# EAGLE design FreedomWingSMD (EAGLE 9.6.2)
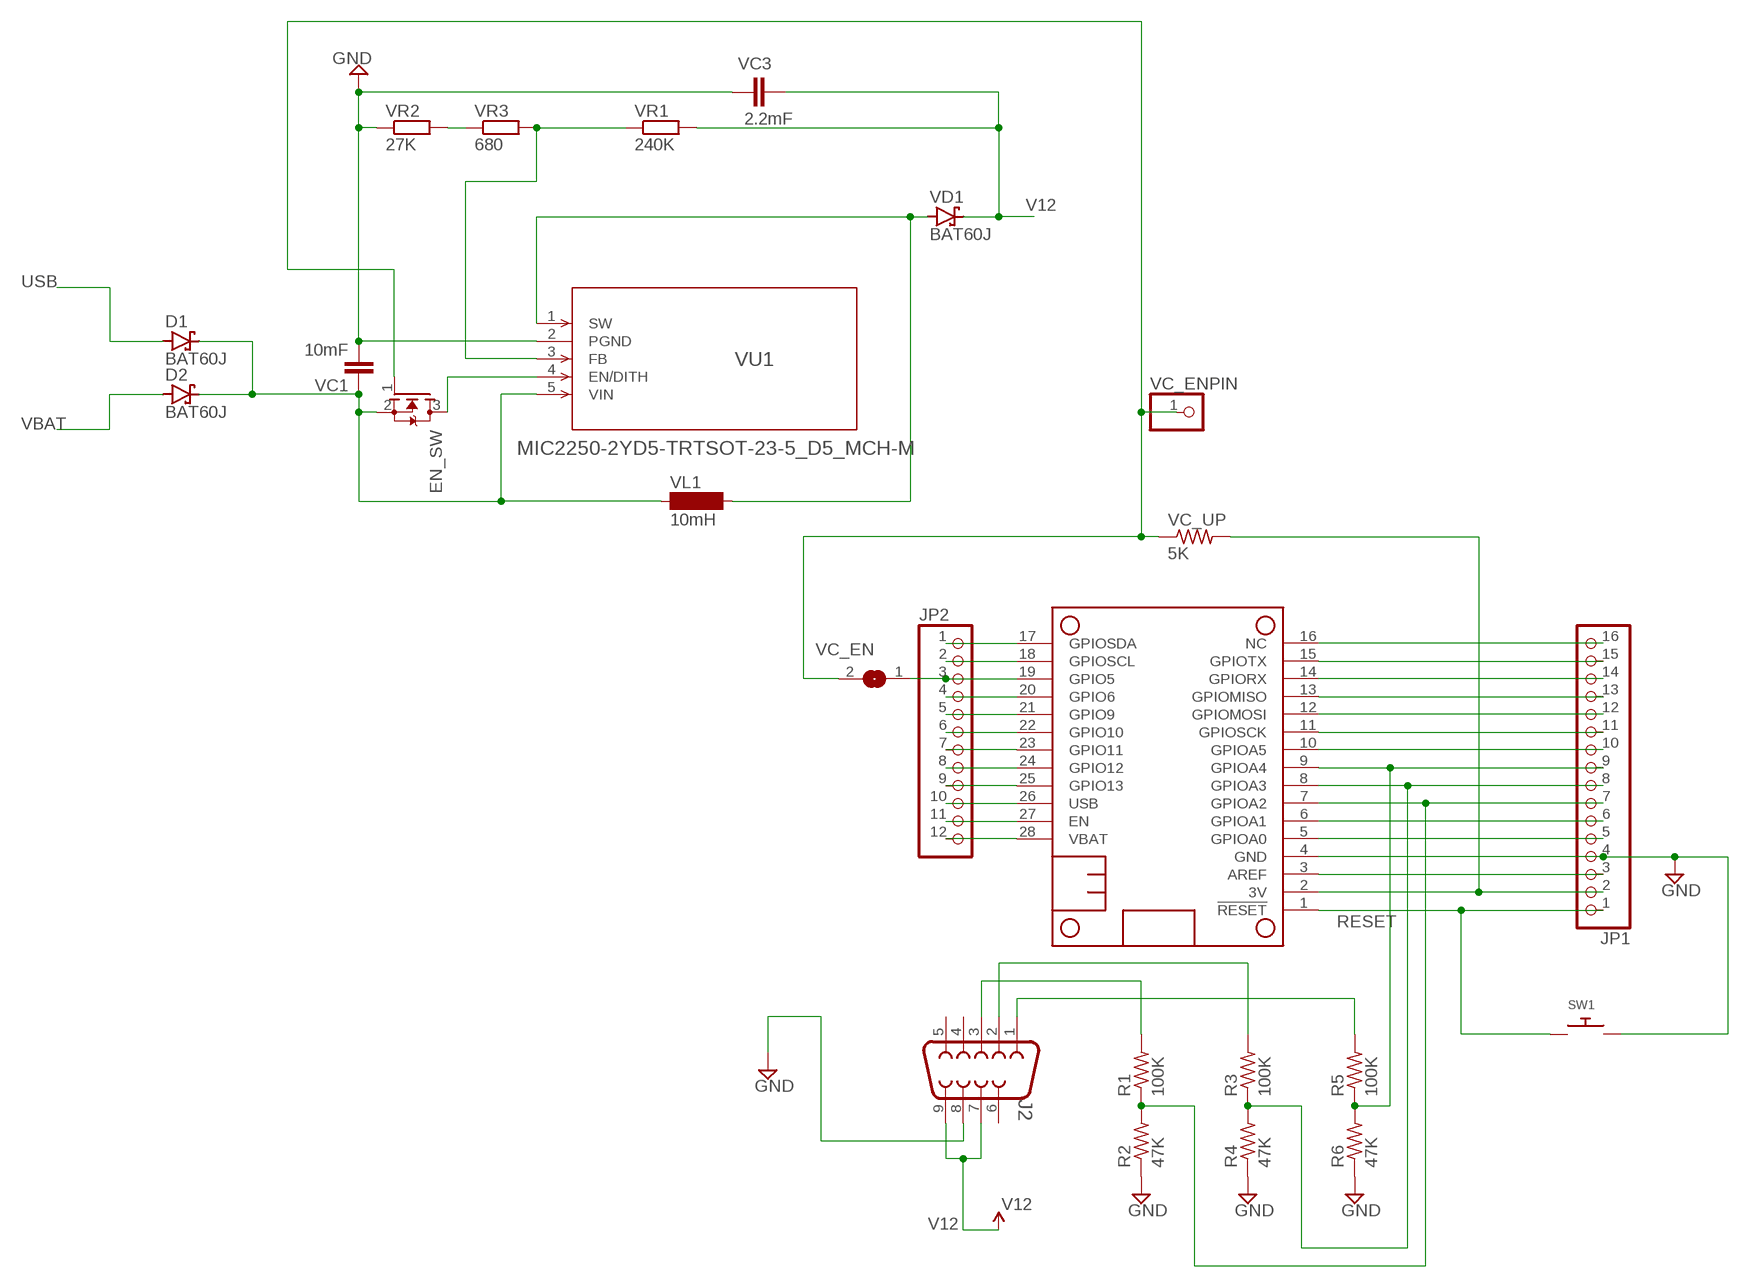
[diagram p0: schematic, sheet 1]

## Parts
D1  BAT60J  [SOD323_ST]
D2  BAT60J  [SOD323_ST]
EN_SW  MOSFET-NREFLOW  [SOT23]
J2  DB9MALE  [DB9_MALE]
JP1  PINHD-1X16  [1X16]
JP2  PINHD-1X12  [1X12]
MS1  FEATHERWING_NODIM  [FEATHERWING_DIM]
R1  100K  R-US_R0805  [R0805]
R2  47K  R-US_R0805  [R0805]
R3  100K  R-US_R0805  [R0805]
R4  47K  R-US_R0805  [R0805]
R5  100K  R-US_R0805  [R0805]
R6  47K  R-US_R0805  [R0805]
SW1  SWITCH_PUSHBUTTONC&K_KSS  [BTN_CK_KSS]
VC1  10mF  C-EUC0805  [C0805]
VC3  2.2mF  C-EUC0805  [C0805]
VC_EN  SJW  [SJW]
VC_ENPIN  PINHD-1X1  [1X01]
VC_UP  5K  R-US_R0805  [R0805]
VD1  BAT60J  [SOD323_ST]
VL1  10mH  MS50  [MS50]
VR1  240K  R-EU_R0805W  [R0805W]
VR2  27K  R-EU_R0805W  [R0805W]
VR3  680  R-EU_R0805W  [R0805W]
VU1  MIC2250-2YD5-TRTSOT-23-5_D5_MCH-M  [TSOT-23-5_D5_MCH-M]

## Nets
3V: JP1.2 MS1.2(3V) VC_UP.2
GND: J2.8 JP1.4 MS1.4(GND) R2.1 R4.1 R6.1 SW1.P$2 VC1.2 VC3.1 VR2.1 VU1.2(PGND)
N$1: J2.3 R1.2
N$2: JP2.1 MS1.17(GPIOSDA)
N$3: JP2.2 MS1.18(GPIOSCL)
N$4: JP2.3 MS1.19(GPIO5) VC_EN.1
N$5: JP1.7 MS1.7(GPIOA2) R1.1 R2.2
N$6: JP1.8 MS1.8(GPIOA3) R3.1 R4.2
N$7: JP1.9 MS1.9(GPIOA4) R5.1 R6.2
N$8: VR1.1 VR3.2 VU1.3(FB)
N$9: J2.2 R3.2
N$10: J2.1 R5.2
N$11: JP2.4 MS1.20(GPIO6)
N$12: JP2.5 MS1.21(GPIO9)
N$13: JP2.6 MS1.22(GPIO10)
N$14: JP2.7 MS1.23(GPIO11)
N$15: JP2.8 MS1.24(GPIO12)
N$16: JP2.9 MS1.25(GPIO13)
N$17: JP1.10 MS1.10(GPIOA5)
N$18: JP1.16 MS1.16(NC)
N$19: JP1.15 MS1.15(GPIOTX)
N$20: JP1.14 MS1.14(GPIORX)
N$21: JP1.13 MS1.13(GPIOMISO)
N$22: JP1.12 MS1.12(GPIOMOSI)
N$23: JP1.11 MS1.11(GPIOSCK)
N$24: JP2.11 MS1.27(EN)
N$25: EN_SW.3(D) VU1.4(EN/DITH)
N$26: VD1.A VL1.2 VU1.1(SW)
N$27: JP1.3 MS1.3(AREF)
N$28: EN_SW.1(G) VC_EN.2 VC_ENPIN.1 VC_UP.1
N$29: JP1.6 MS1.6(GPIOA1)
N$30: JP1.5 MS1.5(GPIOA0)
N$31: VR2.2 VR3.1
RESET: JP1.1 MS1.1(!RESET) SW1.P$1
USB: D1.A JP2.10 MS1.26(USB)
V12: J2.7 J2.9 VC3.2 VD1.C VR1.2
VBAT: D2.A JP2.12 MS1.28(VBAT)
VMAX: D1.C D2.C EN_SW.2(S) VC1.1 VL1.1 VU1.5(VIN)
Unconnected: J2.4 J2.5 J2.6

## Library data of the parts
D1 D2 VD1 = diode:BAT60J: Schottky barrier diode Source: www.st.com, BAT60J.pdf
EN_SW = adafruit:MOSFET-N: N-Channel Mosfet 2N7002E - 60V 260mA SOT23 [Digikey: 2N7002ET1GOSTR-ND] - REEL BSH103 - 30V 850mA SOT23 [Digikey: 568-5013-1-ND]
J2 = SparkFun-Connectors:DB9: DB9 Connector Standard DB9 (D-Sub 9) serial connector. Can be used for CAN bus as well as RS485 and RS232. Footprint production proven. Here is the female version connector we sell at SparkFun: 9 Pin Female Serial Connector - PCB Mount <https://www.sparkfun.com/products/429> (PRT-00429) This connector has been used on the following SparkFun products: SparkFun RS232 Shifter - SMD <https://www.sparkfun.com/products/449> (PRT-00449) SparkFun RS232 Shifter SMD (No DB9) <https://www.sparkfun.com/products/8780> (PRT-08780); PROD_ID: CONN-09904
JP1 = pinhead:PINHD-1X16: PIN HEADER
JP2 = pinhead:PINHD-1X12: PIN HEADER
MS1 = adafruit:FEATHERWING
R1-R6 VC_UP = adafruit:R-US_: RESISTOR, American symbol
SW1 = adafruit:SWITCH_PUSHBUTTON: Buttons SOFTTOUCHSMD_SJ - Soft touch temporary push button (Super Junk Akihabara) Compatible with SKPMANE010 [Mouser: 688-SKPMAN] C&K_KSS = Digikey: KSS221GLFS
VC1 VC3 = rcl:C-EU: CAPACITOR, European symbol; SPICEPREFIX: C
VC_EN = jumper:SJ: SMD solder JUMPER
VC_ENPIN = adafruit:PINHD-1X1: Pin header 1x1 for 0.1" spacing With round pins
VL1 = inductor-neosid:MS50: INDUCTOR SMD power inductor; OC_FARNELL: unknown; OC_NEWARK: unknown
VR1-VR3 = rcl:R-EU_: RESISTOR, European symbol; SPICEPREFIX: R
VU1 = ATMakers:MIC2250-2YD5-TR; BUILT_BY: EMA_Jessica; COPYRIGHT: Copyright (C) 2018 Accelerated Designs. All rights reserved; MANUFACTURER_PART_NUMBER: MIC2250-2YD5-TR; SOURCELIBRARY: Microchip_2019-08-23_2; VENDOR: Microchip

## Board
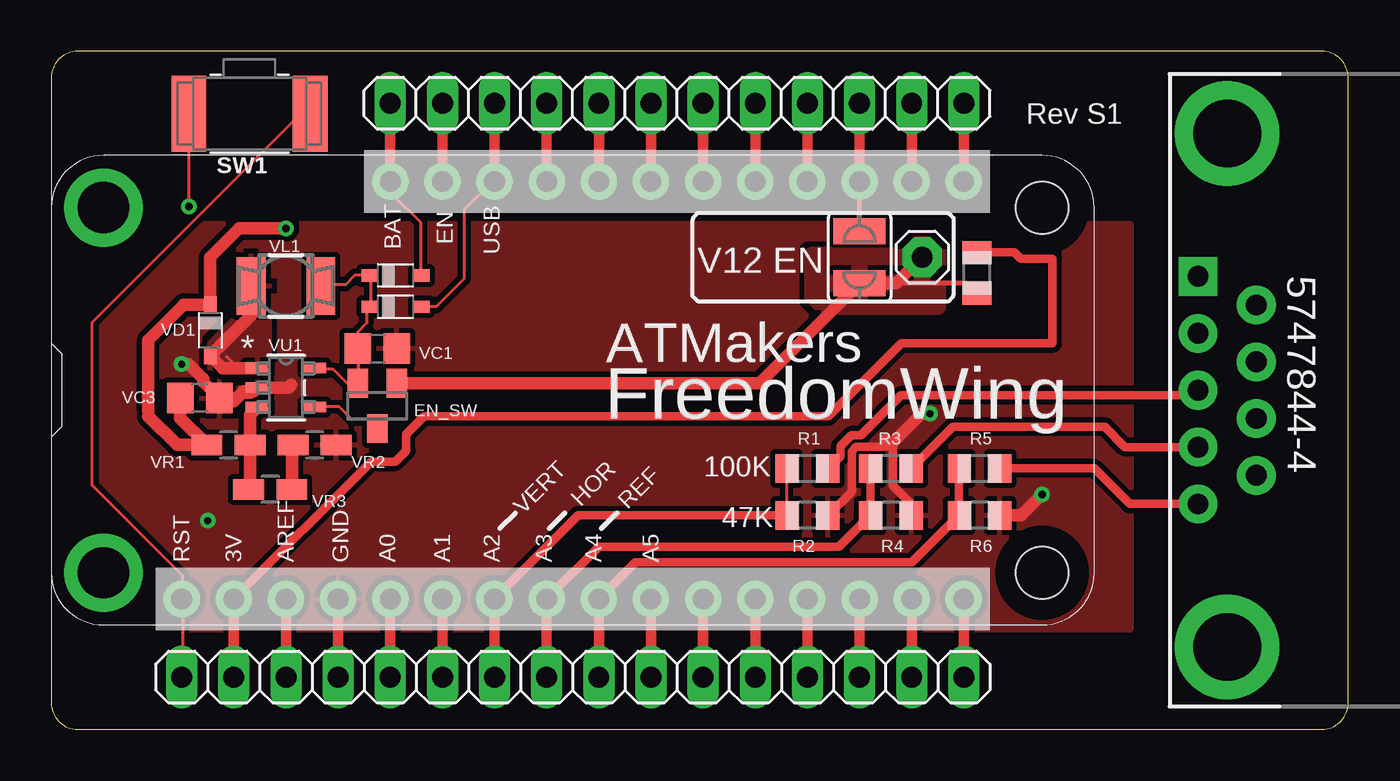
[diagram p1: board, top side]
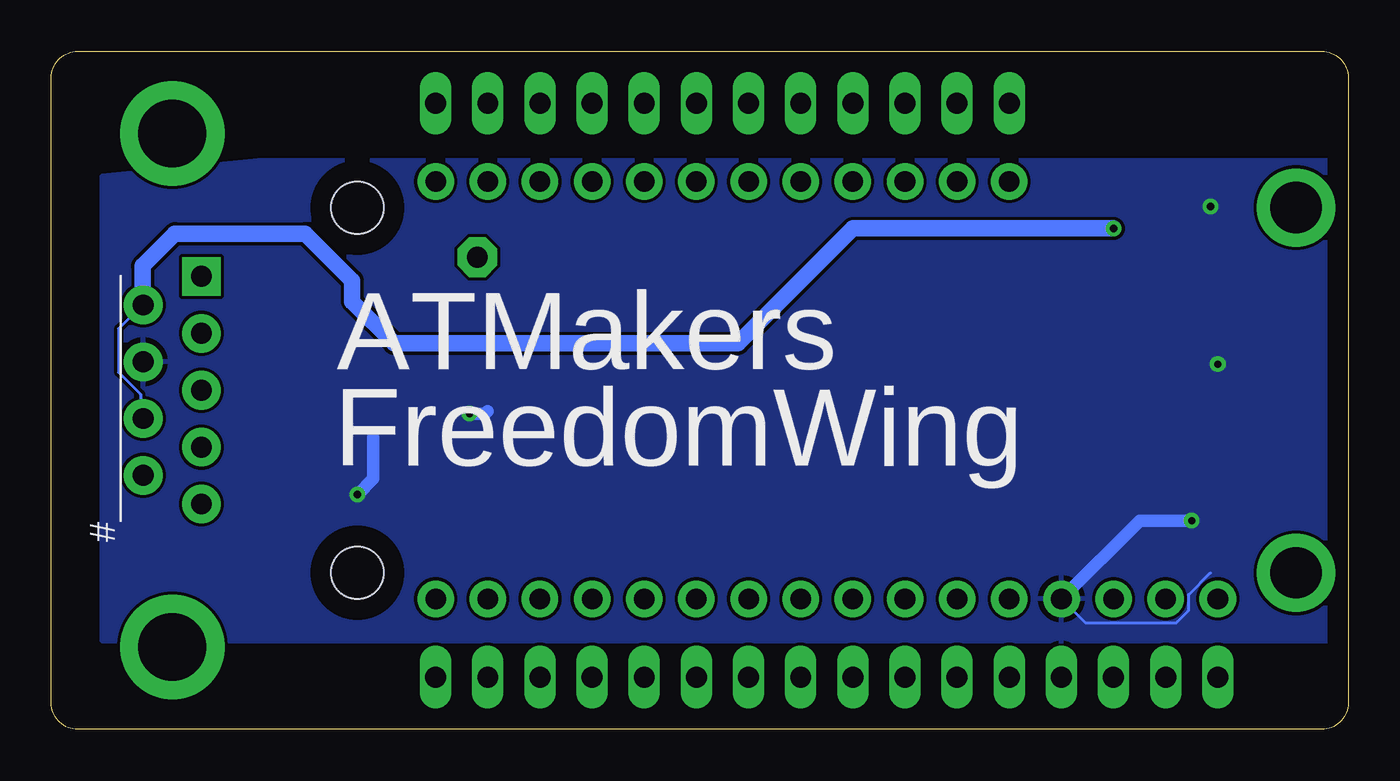
[diagram p2: board, bottom side, seen from below]

Size 63.17 x 33.01 mm. Coordinates in mm from the lower left corner, seen from the top.
Outline: 0,31.74 0,1.27 arc90 1.27,0 61.9,0 arc90 63.17,1.27 63.17,31.74 arc90 61.9,33.01 1.27,33.01 arc90 0,31.74
Copper layers (1*16): Top 0.035mm / dielectric 1.5mm / Bottom 0.035mm
Design rules "default *": minimum track width 6mil, minimum drill 0.35mm, track to track 6mil, track to pad 6mil, pad to pad 6mil, via to via 6mil, smd to smd 6mil, copper to edge 40mil, drill to drill 6mil, minimum pad ring 10mil, minimum via ring 8mil, stop-mask expansion 4mil, vias tented up to drill 20mil, thermal gap 10mil

### Footprints (pad centres in the part's own frame; a part is rotated, then mirrored left to right if it is on the bottom)
SOD323_ST = smd 0.8 x 0.6: A 1.25,0; C -1.25,0
SOT23 = smd 1 x 1.4: 1 -0.95,-1.1; 2 0.95,-1.1; 3 0,1.1
DB9_MALE = drill 1.016 pad 1.88: 1 5.54,-1.42; 2 2.77,-1.42; 3 0,-1.42; 4 -2.77,-1.42; 6 4.15,1.42; 7 1.38,1.42; 8 -1.38,1.42; 9 -4.15,1.42 | drill 1.016 pad 1.88 square: 5 -5.54,-1.42 | drill 3.302 pad 5.08: G1 -12.5,0; G2 12.5,0
1X16 = drill 1.016 long: 1 -19.05,0; 2 -16.51,0; 3 -13.97,0; 4 -11.43,0; 5 -8.89,0; 6 -6.35,0; 7 -3.81,0; 8 -1.27,0; 9 1.27,0; 10 3.81,0; 11 6.35,0; 12 8.89,0; 13 11.43,0; 14 13.97,0; 15 16.51,0; 16 19.05,0
1X12 = drill 1.016 long: 1 -13.97,0; 2 -11.43,0; 3 -8.89,0; 4 -6.35,0; 5 -3.81,0; 6 -1.27,0; 7 1.27,0; 8 3.81,0; 9 6.35,0; 10 8.89,0; 11 11.43,0; 12 13.97,0
FEATHERWING_DIM = drill 1 pad 1.778: 1 6.35,1.27; 2 8.89,1.27; 3 11.43,1.27; 4 13.97,1.27; 5 16.51,1.27; 6 19.05,1.27; 7 21.59,1.27; 8 24.13,1.27; 9 26.67,1.27; 10 29.21,1.27; 11 31.75,1.27; 12 34.29,1.27; 13 36.83,1.27; 14 39.37,1.27; 15 41.91,1.27; 16 44.45,1.27; 17 44.45,21.59; 18 41.91,21.59; 19 39.37,21.59; 20 36.83,21.59; 21 34.29,21.59; 22 31.75,21.59; 23 29.21,21.59; 24 26.67,21.59; 25 24.13,21.59; 26 21.59,21.59; 27 19.05,21.59; 28 16.51,21.59 | drill 2.5 pad 3.81: P$1 2.54,20.32; P$2 2.54,2.54 | hole 2.54: 48.26,20.32; 48.26,2.54
R0805 = smd 1.1 x 1.4: 1 -1,0; 2 1,0
BTN_CK_KSS = smd 1.7 x 3.7: P$1 -2.95,0; P$2 2.95,0
C0805 = smd 1.3 x 1.5: 1 -0.95,0; 2 0.95,0
SJW = smd 1.27 x 2.54: 1 -1.27,0; 2 1.27,0
1X01 = drill 1.016 pad 1.93 octagon: 1 0,0
MS50 = smd 2.8 x 1.4: 1 0,-1.7; 2 0,1.7
R0805W = smd 1.5 x 1: 1 -1.052,0; 2 1.052,0
TSOT-23-5_D5_MCH-M = smd 1.156 x 0.508: 1 -1.378,0.95; 2 -1.378,0; 3 -1.378,-0.95; 4 1.378,-0.95; 5 1.378,0.95

### Placement (x,y rotation side)
D1  16.76,20.57 0 top
D2  16.76,22.1 0 top
EN_SW  15.88,15.75 180 top
J2  57.28,16.51 270 top
JP1  25.4,2.54 0 top
JP2  30.48,30.48 180 top
MS1  0,5.08 0 top
R1  36.83,12.7 0 top
R2  36.83,10.41 180 top
R3  40.89,12.7 0 top
R4  40.89,10.41 180 top
R5  45.21,12.7 0 top
R6  45.21,10.41 180 top
SW1  9.65,29.97 180 top
VC1  15.88,18.54 0 top
VC3  7.24,16.13 180 top
VC_EN  39.37,22.99 270 top
VC_ENPIN  42.42,22.99 0 top
VC_UP  45.09,22.23 90 top
VD1  7.75,19.43 270 top
VL1  11.43,21.59 90 top
VR1  8.64,13.84 180 top
VR2  12.83,13.84 180 top
VR3  10.67,11.68 180 top
VU1  11.43,16.64 0 top

### Tracks (layer width: path | path; a pad name or v marks a point on that pad's centre or on a via)
3V
  Top 0.406: VC_UP.2 46.91,23.23 47.23,22.91 48.77,22.91 48.77,18.8 41.4,18.8 37.85,15.24 18.17,15.24 17.29,14.36 17.29,13.57 16.75,13.03 15.57,13.03 MS1.2
  Top 0.508: MS1.2 JP1.2
GND  (via drill 0.35)
  Top 0.152: SW1.P$2 6.71,29.87 v6.71,25.45 6.71,25.4
  Top 0.406: VU1.2 9.71,16.3 9.33,16.3 8.9,15.88 | R2.1 38.99,11.57 38.99,13.55 39.2,13.76 40.64,13.76 40.64,14.22 40.99,13.88 | R4.1 41.89,10.95 40.99,11.85 40.99,13.88 | 40.99,13.97 40.99,13.88
  Top 0.508: JP1.4 MS1.4
  Top 0.61: v42.8,15.37 42.38,15.37 40.99,13.97 | R6.1 47.24,10.41 v48.26,11.43 | v6.35,17.78 6.68,17.78 7.4,17.07 7.4,16.92 VC3.1 9.02,16.13 9.34,16.45 9.86,16.45 VU1.2 11.56,16.64 11.68,16.76
  Bottom 0.152: 6.71,7.62 7.77,6.55 7.77,5.79 8.38,5.18 12.8,5.18 MS1.4
  Bottom 0.61: v42.8,15.37 42.04,15.37 41.91,15.49 | v48.26,11.43 47.5,12.19 47.5,14.22 | MS1.4 10.16,10.16 v7.62,10.16
  pour Top (isolate 0.254, rank 3): 0.25,24.64 52.58,24.64 52.58,4.83 0.51,4.83 0.25,5.08 0.25,24.38
  pour Bottom (rank 2): 0.51,27.69 53.09,27.69 60.71,26.92 60.71,4.32 0.76,4.32 0.51,4.57
N$1
  Top 0.406: J2.3 55.6,16.26 41.39,16.26 39.44,14.31 38.97,14.31 38.43,13.78 38.43,13.3 R1.2
N$2
  Top 0.508: MS1.17 JP2.1
N$3
  Top 0.508: JP2.2 MS1.18
N$4
  Top 0.254: VC_EN.1 MS1.19
  Top 0.508: MS1.19 JP2.3
N$5
  Top 0.152: R2.2 35.81,10.52 35.81,12.19 R1.1
  Top 0.406: MS1.7 25.66,10.42 R2.2
  Top 0.508: MS1.7 JP1.7
N$6
  Top 0.406: MS1.8 26.67,8.89 38.37,8.89 R4.2 R3.1
  Top 0.508: JP1.8 MS1.8
N$7
  Top 0.406: MS1.9 28.45,8.13 41.93,8.13 R6.2 R5.1
  Top 0.508: MS1.9 JP1.9
N$8
  Top 0.61: VU1.3 9.69,15.32 VR1.1 9.69,11.76 VR3.2
N$9
  Top 0.406: J2.2 52.3,13.74 51.31,14.73 43.93,14.73 R3.2
N$10
  Top 0.406: J2.1 52.53,10.97 50.8,12.7 R5.2
N$11
  Top 0.508: JP2.4 MS1.20
N$12
  Top 0.508: MS1.21 JP2.5
N$13
  Top 0.508: JP2.6 MS1.22
N$14
  Top 0.508: MS1.23 JP2.7
N$15
  Top 0.508: JP2.8 MS1.24
N$16
  Top 0.508: MS1.25 JP2.9
N$17
  Top 0.508: JP1.10 MS1.10
N$18
  Top 0.508: MS1.16 JP1.16
N$19
  Top 0.508: MS1.15 JP1.15
N$20
  Top 0.508: MS1.14 JP1.14
N$21
  Top 0.508: MS1.13 JP1.13
N$22
  Top 0.508: MS1.12 JP1.12
N$23
  Top 0.508: MS1.11 JP1.11
N$24
  Top 0.508: MS1.27 JP2.11
N$25
  Top 0.152: VU1.4 12.95,15.7 14.02,15.7 14.63,15.09 15.54,15.09 15.85,14.78 EN_SW.3
N$26
  Top 0.152: 8.53,18.14 9.14,17.53 9.91,17.53 VU1.1 | 9.75,21.49 VL1.2
  Top 0.61: VL1.2 9.73,20.16 VD1.A 8.34,17.59 VU1.1
  pour Top (rank 2): 9.14,23.11 10.16,23.11 10.67,22.61 10.67,17.78 10.41,17.53 7.62,17.53 7.62,18.8 9.14,20.32
N$27
  Top 0.508: JP1.3 MS1.3
N$28
  Top 0.254: VC_UP.1 44.59,21.72 VC_EN.2
  Top 0.61: VC_ENPIN.1 41.15,21.72 VC_EN.2 34.5,16.85 EN_SW.1
  pour Top: 37.08,23.11 41.66,23.11 42.16,23.62 43.18,23.62 43.18,20.57 37.59,20.57 37.08,21.08
N$29
  Top 0.508: MS1.6 JP1.6
N$30
  Top 0.508: MS1.5 JP1.5
N$31
  Top 0.61: VR3.1 11.72,13.79 VR2.2
RESET
  Top 0.152: JP1.1 6.4,2.59 6.4,6.25 MS1.1 6.4,6.4 6.4,7.47 1.98,11.89 1.98,19.81 12.04,29.87 12.5,29.87 SW1.P$1
USB
  Top 0.152: D1.A 18.75,20.57 20.12,21.95 20.12,25.3 21.49,26.67 MS1.26
  Top 0.508: JP2.10 MS1.26
V12  (via drill 0.35)
  Top 0.152: 4.72,15.24 4.72,15.49
  Top 0.61: VC3.2 6.29,15.14 VR1.2 6.12,13.84 4.72,15.24 | v11.43,24.38 9.14,24.38 7.75,22.99 VD1.C 6.46,20.68 4.72,18.95 4.72,15.49
  Bottom 0.152: J2.7 58.83,15.24 58.83,16.31 59.89,17.37 59.89,19.51 58.83,20.57 J2.9
  Bottom 0.813: J2.9 58.71,20.64 58.72,20.64 58.72,22.56 57.15,24.13 50.8,24.13 48.51,21.85 48.51,20.83 46.48,18.8 29.72,18.8 24.13,24.38 v11.43,24.38
VBAT
  Top 0.152: D2.A 17.98,22.1 17.98,24.69 16.61,26.06 16.61,26.52 MS1.28
  Top 0.508: JP2.12 MS1.28
VMAX
  Top 0.152: VU1.5 12.95,17.53 13.72,17.53 14.48,16.76 14.78,16.76 EN_SW.2 14.94,16.92 14.94,18.44 VC1.1 14.94,18.59 14.94,19.36 15.39,19.81 15.39,20.57 D1.C 15.54,20.57 15.54,22.1 D2.C 14.78,22.1 14.33,21.64 13.26,21.64 VL1.1

### Text on the board
tPlace: Rev S1 | EN | BAT | USB | V12 EN | 5747844-4 | ATMakers | FreedomWing | HOR | REF | VERT | RST | 3V | AREF | GND | A0 | A1 | A2 | A3 | A4 | A5
bPlace: #____________ | ATMakers | FreedomWing